# EasyEDA schematic SCH_Driver_Key_PCB_3.5_3.8_5.0_2022-10-01.json
TITLE: Sheet_1; REV: 1.0; Date: 2022-06-10; Sheet: 1/1; Company: Your Company
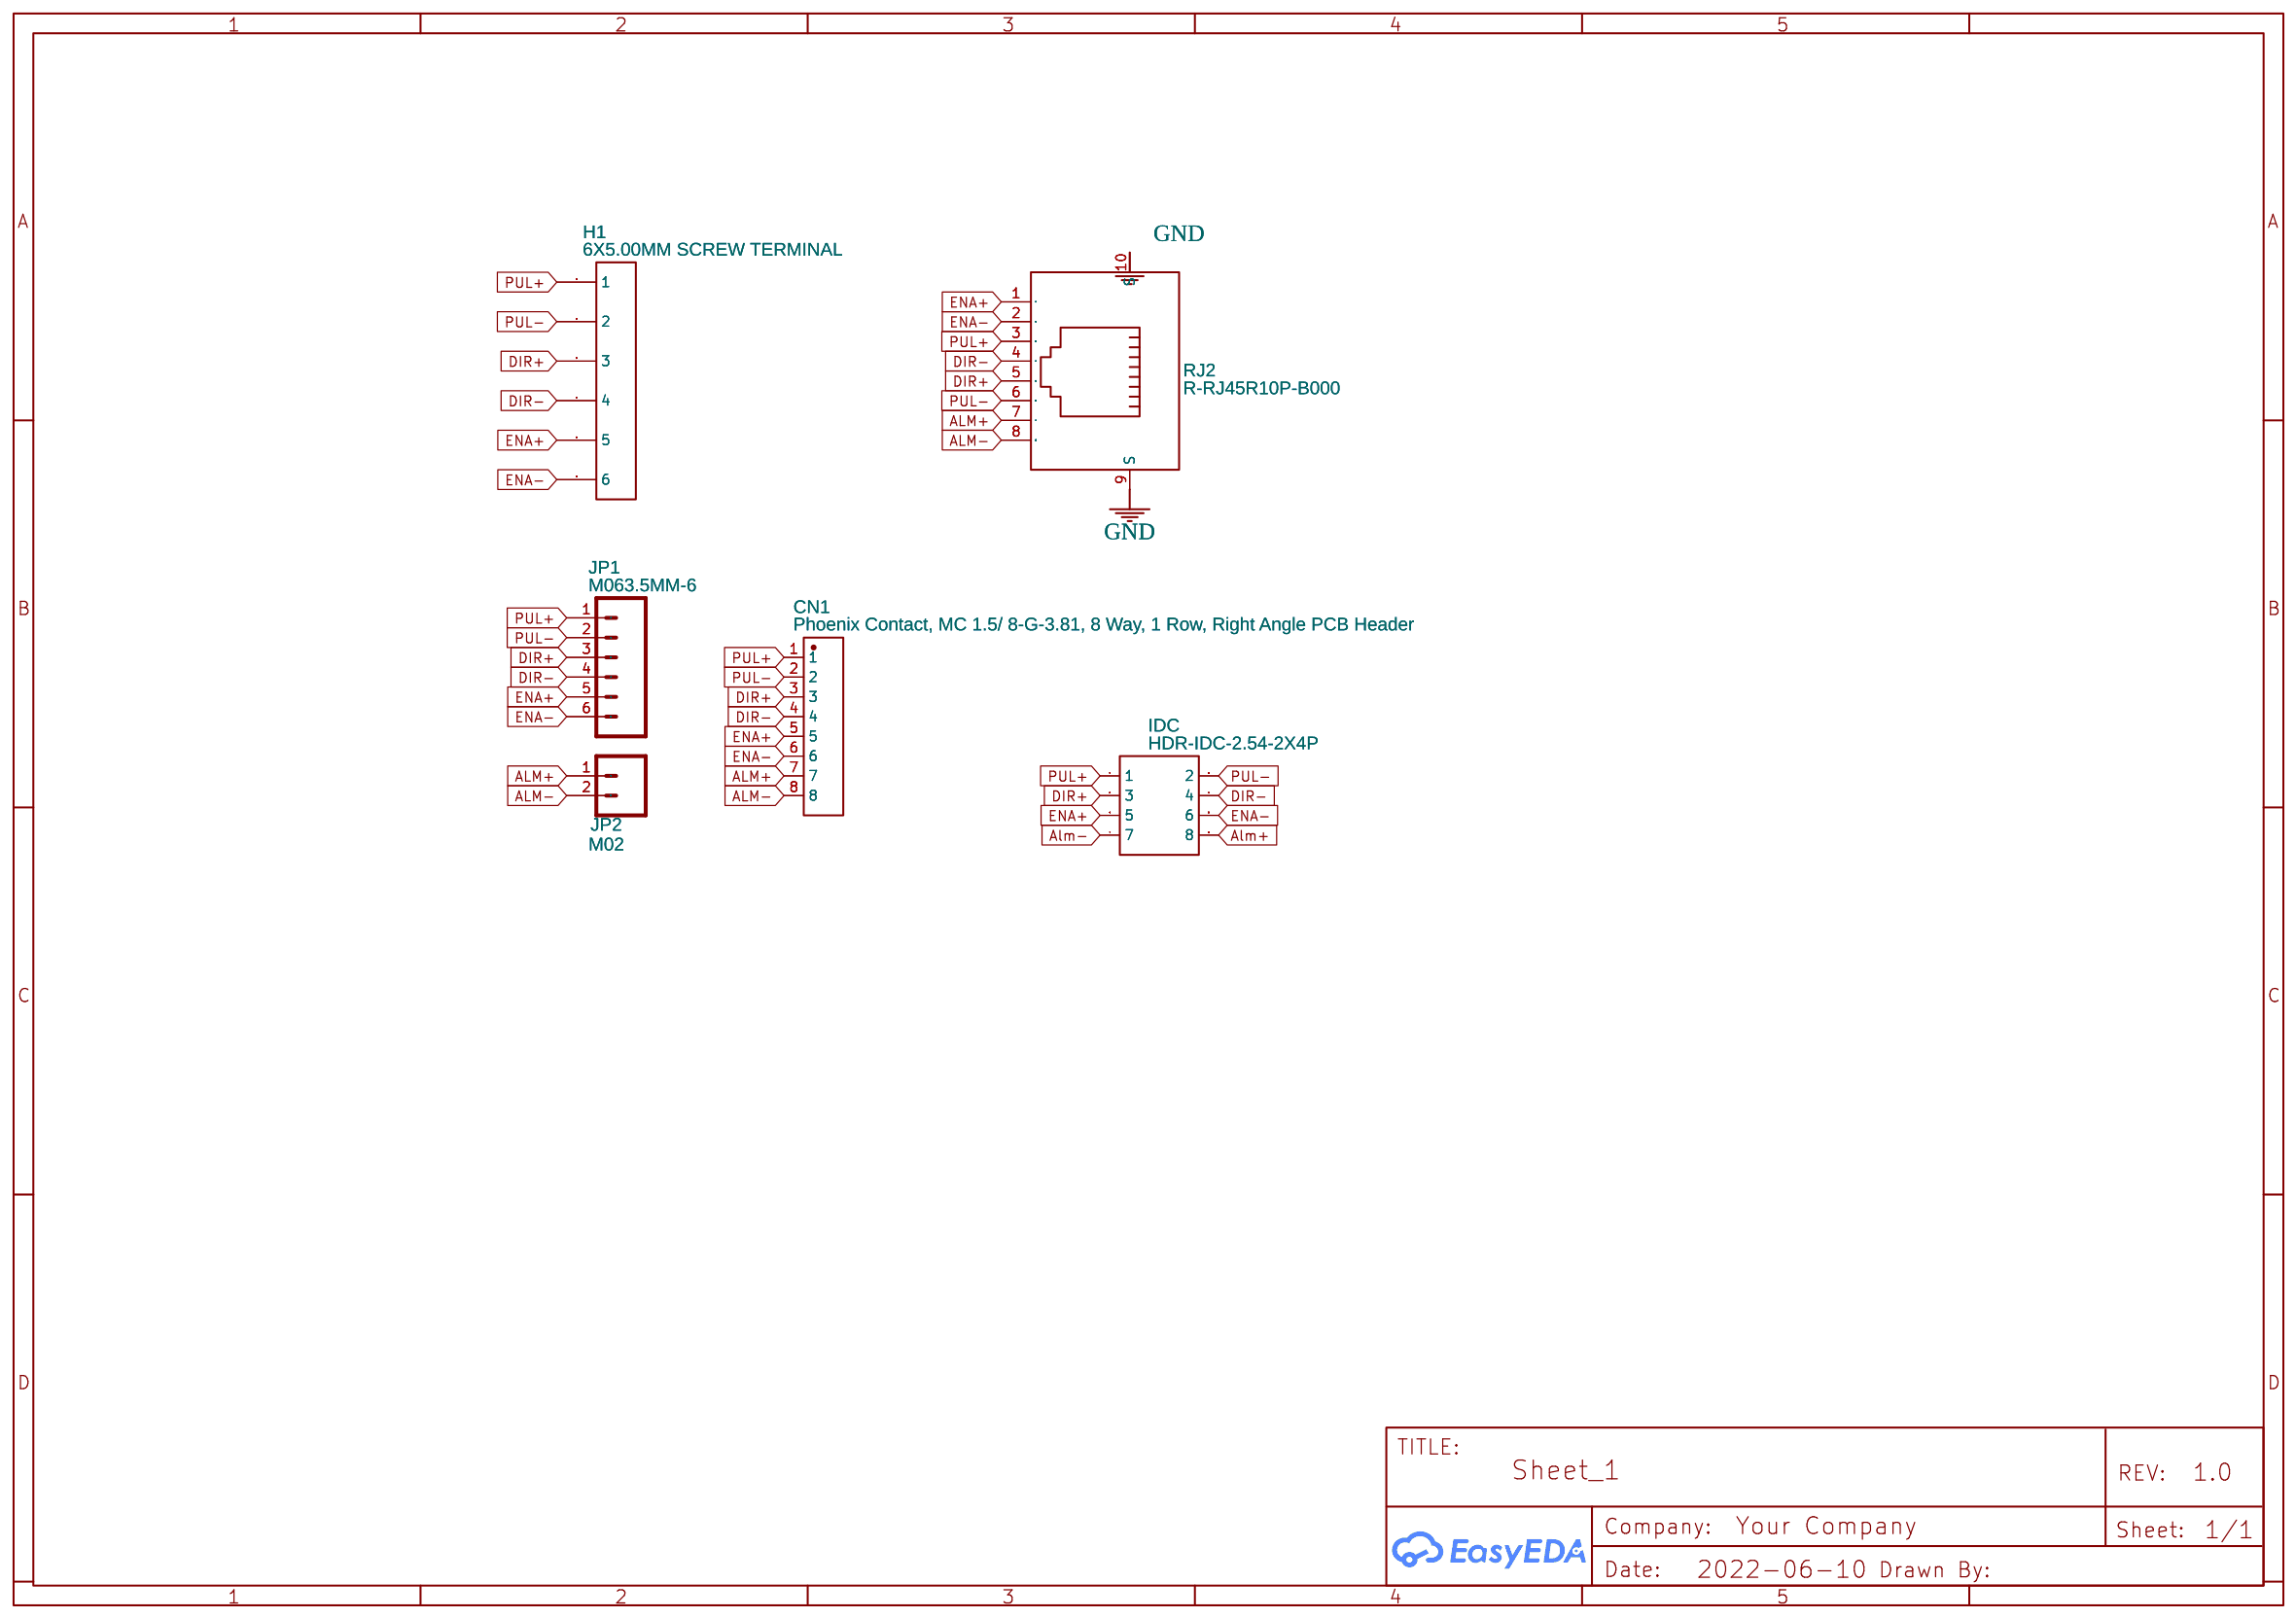
[diagram p0: schematic sheet]

## Parts
CN1  Phoenix Contact, MC 1.5/ 8-G-3.81, 8 Way, 1 Row, Right Angle PCB Header  [CONN-TH_1803484]
H1  6X5.00MM SCREW TERMINAL  [6X5.00MM SCREW TERMINAL]
IDC  HDR-IDC-2.54-2X4P  [IDC-TH_8P-P2.54-V-R2-C4-S2.54]
JP1  M063.5MM-6  [SCREWTERMINAL-3.5MM-6]
JP2  M02  [SCREWTERMINAL-3.5MM-2]
RJ2  R-RJ45R10P-B000  [RJ45-TH_R-RJ45R10P-B000]

## Library data of the parts
CN1 = Phoenix Contact, MC 1.5/ 8-G-3.81, 8 Way, 1 Row, Right Angle PCB Header: Supplier: RS-Online; Supplier Part: 220-4793; Manufacturer: Phoenix Contact; Manufacturer Part: 1803332; Contributor: Glenny; JLCPCB Part Class: Extended Part
H1 = 6X5.00MM SCREW TERMINAL: Contributor: porkyneal
IDC = HDR-IDC-2.54-2X4P: Supplier: LCSC; Manufacturer: BOOMELE; Manufacturer Part: IDC Box 2X4 2.54MM; Supplier Part: C9135; JLCPCB Part Class: Extended Part
JP1 = M063.5MM-6: Header 6; Contributor: SparkFun
JP2 = M02: Contributor: SparkFun
RJ2 = R-RJ45R10P-B000: Supplier: LCSC; Supplier Part: C386758; Manufacturer: Shenzhen Cankemeng; Contributor: LCSC; JLCPCB Part Class: Extended Part

## Nets
GND: RJ2.9(S) RJ2.10(S)
ALM+: CN1.7 JP2.1 RJ2.7
Alm+: IDC.8
ALM-: CN1.8 JP2.2 RJ2.8
Alm-: IDC.7
DIR+: CN1.3 H1.3 IDC.3 JP1.3 RJ2.5
DIR-: CN1.4 H1.4 IDC.4 JP1.4 RJ2.4
ENA+: CN1.5 H1.5 IDC.5 JP1.5 RJ2.1
ENA-: CN1.6 H1.6 IDC.6 JP1.6 RJ2.2
PUL+: CN1.1 H1.1 IDC.1 JP1.1 RJ2.3
PUL-: CN1.2 H1.2 IDC.2 JP1.2 RJ2.6
